# Altium project Controller.PrjPcb (part 5 of 5)

## Sheet bluetooth.SchDoc
size A4; SheetNumber: 4; SheetTotal: 8
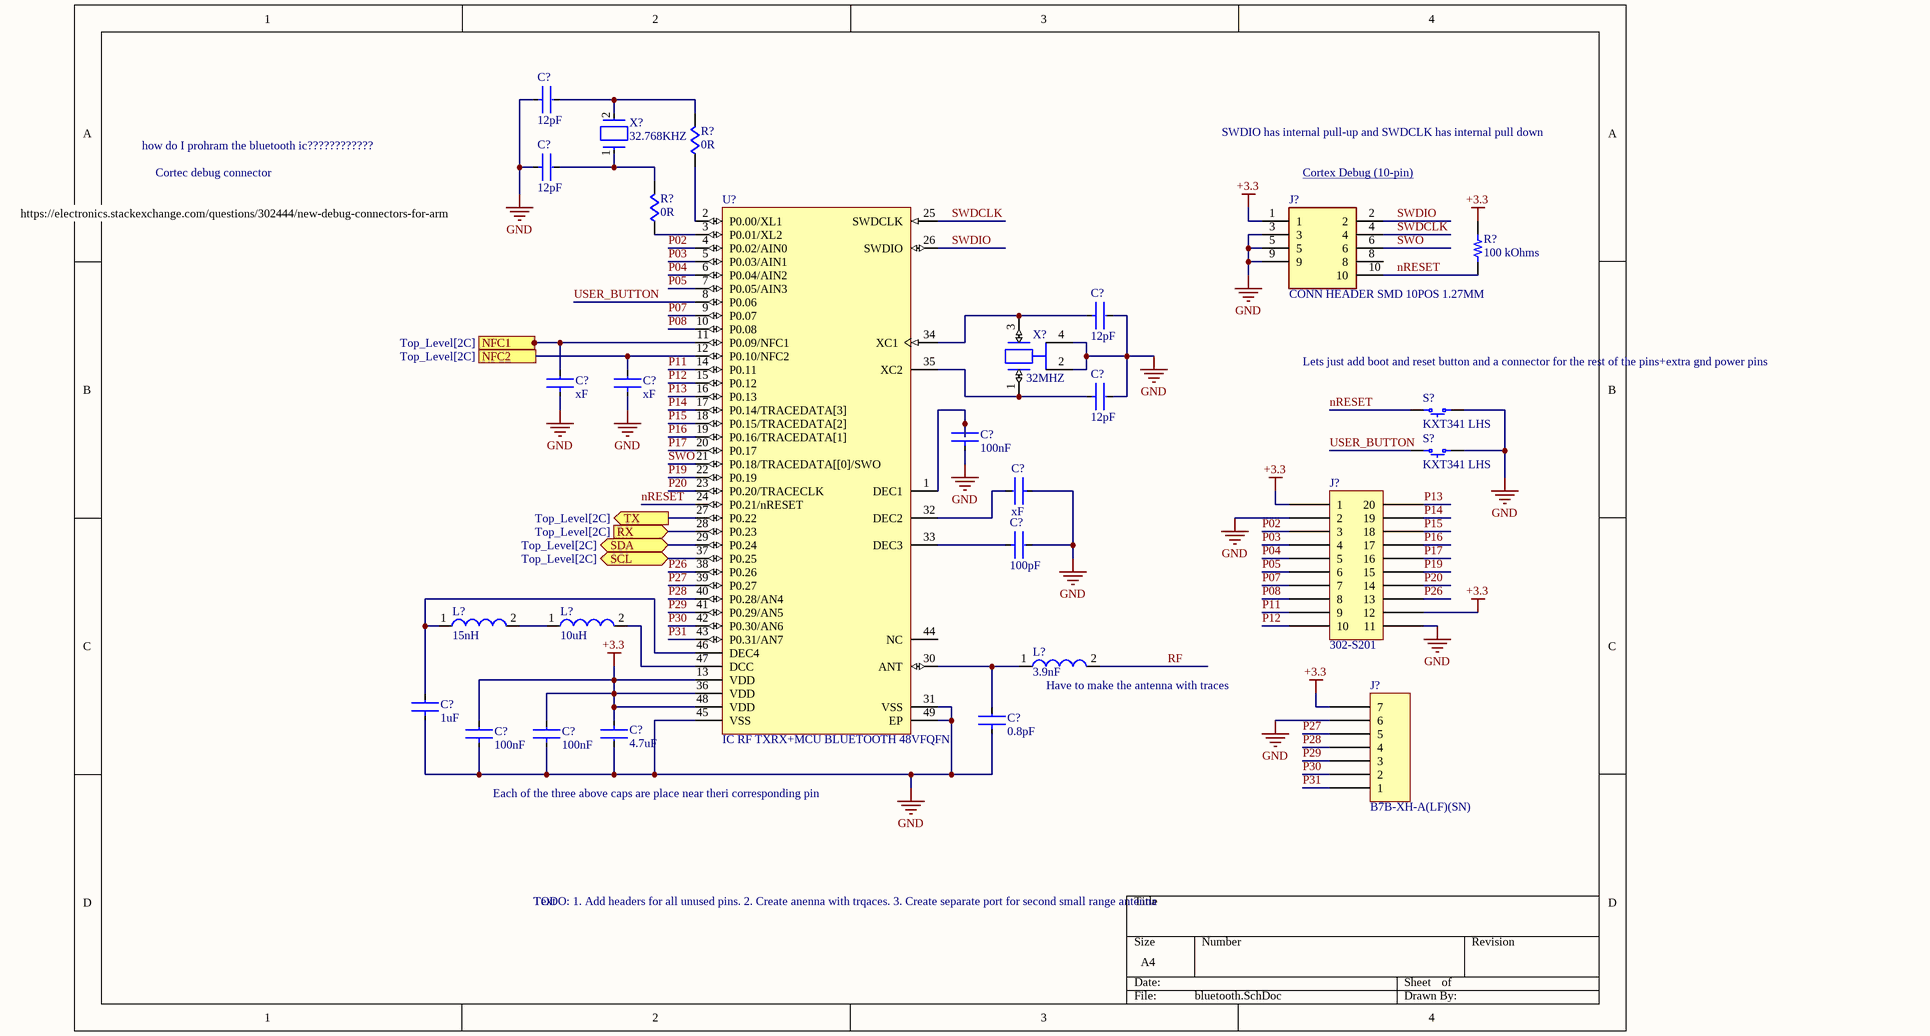
[diagram p5: bluetooth.SchDoc]

### Parts
(Parts that share a designator on the sheet are numbered #1, #2 ... from top to bottom, then left to right.)
C?#26  value 12pF  [FP-GCM155-0_05-IPC_C]  (hidden comment: NPO, +-2%)
C?#27  value 12pF  [FP-GCM155-0_05-IPC_C]  (hidden comment: NPO, +-2%)
C?#28  value 12pF  [FP-GCM155-0_05-IPC_C]  (hidden comment: NPO, +-2%)
C?#29  value xF  [FP-GCM155-0_05-IPC_C]  (hidden comment: tune)
C?#30  value xF  [FP-GCM155-0_05-IPC_C]  (hidden comment: tune)
C?#31  value 12pF  [FP-GCM155-0_05-IPC_C]  (hidden comment: NPO, +-2%)
C?#32  value 100nF  [FP-GCM155-0_05-IPC_C]  (hidden comment: X7R, +-10%)
C?#33  value xF  [FP-GCM155-0_05-IPC_C]  (hidden comment: tune)
C?#34  value 100pF  [FP-GCM155-0_05-IPC_C]  (hidden comment: NP0, +-5%)
C?#35  value 1uF  [FP-CGA3E-0_3-0_1-IPC_C]  (hidden comment: X7R, +-10%)
C?#36  value 0.8pF  [FP-GCM155-0_05-IPC_C]  (hidden comment: NP0, +-5%)
C?#37  value 100nF  [FP-GCM155-0_05-IPC_C]  (hidden comment: X7R, +-10%)
C?#38  value 100nF  [FP-GCM155-0_05-IPC_C]  (hidden comment: X7R, +-10%)
C?#39  value 4.7uF  [FP-CGA3E-0_3-0_1-IPC_C]  (hidden comment: X5R, +-10%)
J?#14  CONN HEADER SMD 10POS 1.27MM  [FTSH10501LDV007K]
J?#15  302-S201  [OST 302-S201]
J?#16  B7B-XH-A(LF)(SN)  [JST XH B7B-XH-A]
L?#2  value 15nH  [FP-LBMF1608-0_8-0_2-IPC_C]  (hidden comment: FIXED IND 15NH 500MA 500MOHM SMD)
L?#3  value 10uH  [FP-MLZ1608-IPC_C]  (hidden comment: FIXED IND 10UH 300MA 600MOHM SMD)
L?#4  value 3.9nF  (hidden comment: FIXED IND 3.9NH 200MA 750MOHM SM)
R?#23  value 0R  [FP-RK73Z1J-IPC_C]  (hidden comment: RES 0 OHM JUMPER 0603)
R?#24  value 0R  [FP-RK73Z1J-IPC_C]  (hidden comment: RES 0 OHM JUMPER 0603)
R?#25  100 kOhms  [RES 0402_1005]
S?#4  KXT341 LHS  [C&K KXT3]
S?#5  KXT341 LHS  [C&K KXT3]
U?#3  IC RF TXRX+MCU BLUETOOTH 48VFQFN
X?#2  value 32.768KHZ  [FP-ECX-34Q-MFG]  (hidden comment: ECS-.327-9-34QCS-TR)
X?#3  value 32MHZ  [FP-ECS-320-8-37CKM-MFG]  (hidden comment: CRYSTAL 32.0000MHZ 8PF SMD)

### Ports
NFC1 (see Top_Level[2C]), NFC2 (see Top_Level[2C]), RX (in, see Top_Level[2C]), SCL (bidir, see Top_Level[2C]), SDA (bidir, see Top_Level[2C]), TX (out, see Top_Level[2C])

### Nets
+3.3: C?#37.2 C?#38.2 C?#39.1 J?#14.1 J?#15.1 J?#15.12 J?#16.7 R?#25.2 U?#3.13(VDD) U?#3.36(VDD) U?#3.48(VDD)
GND: C?#26.1 C?#27.1 C?#28.2 C?#29.1 C?#30.1 C?#31.2 C?#32.1 C?#33.1 C?#34.2 C?#35.1 C?#36.1 C?#37.1 C?#38.1 C?#39.2 J?#14.3 J?#14.5 J?#14.9 J?#15.2 J?#15.11 J?#16.6 S?#4.1 S?#5.1 U?#3.31(VSS) U?#3.45(VSS) U?#3.49(EP) X?#3.2(Gnd) X?#3.4(Gnd)
nRESET: J?#14.10 R?#25.1 S?#4.2 U?#3.24(P0.21/nRESET)
P02: J?#15.3 U?#3.4(P0.02/AIN0)
P03: J?#15.4 U?#3.5(P0.03/AIN1)
P04: J?#15.5 U?#3.6(P0.04/AIN2)
P05: J?#15.6 U?#3.7(P0.05/AIN3)
P07: J?#15.7 U?#3.9(P0.07)
P08: J?#15.8 U?#3.10(P0.08)
P11: J?#15.9 U?#3.14(P0.11)
P12: J?#15.10 U?#3.15(P0.12)
P13: J?#15.20 U?#3.16(P0.13)
P14: J?#15.19 U?#3.17(P0.14/TRACEDATA[3])
P15: J?#15.18 U?#3.18(P0.15/TRACEDATA[2])
P16: J?#15.17 U?#3.19(P0.16/TRACEDATA[1])
P17: J?#15.16 U?#3.20(P0.17)
P19: J?#15.15 U?#3.22(P0.19)
P20: J?#15.14 U?#3.23(P0.20/TRACECLK)
P26: J?#15.13 U?#3.38(P0.26)
P27: J?#16.5 U?#3.39(P0.27)
P28: J?#16.4 U?#3.40(P0.28/AN4)
P29: J?#16.3 U?#3.41(P0.29/AN5)
P30: J?#16.2 U?#3.42(P0.30/AN6)
P31: J?#16.1 U?#3.43(P0.31/AN7)
RF: L?#4.2
SWDCLK: J?#14.4 U?#3.25(SWDCLK)
SWDIO: J?#14.2 U?#3.26(SWDIO)
SWO: J?#14.6 U?#3.21(P0.18/TRACEDATA[[0]/SWO)
USER_BUTTON: S?#5.2 U?#3.8(P0.06)
Net*_29: U?#3.37(P0.25) ; port SCL
Net*_43: U?#3.27(P0.22) ; port TX
Net*_53: U?#3.29(P0.24) ; port SDA
Net*_58: U?#3.28(P0.23) ; port RX
NetC?#26_2: C?#26.2 R?#23.2 X?#2.2(Out/In)
NetC?#27_2: C?#27.2 R?#24.2 X?#2.1(In/Out)
NetC?#28_1: C?#28.1 U?#3.34(XC1) X?#3.3(Out/In)
NetC?#29_2: C?#29.2 U?#3.11(P0.09/NFC1) ; port NFC1
NetC?#30_2: C?#30.2 U?#3.12(P0.10/NFC2) ; port NFC2
NetC?#31_1: C?#31.1 U?#3.35(XC2) X?#3.1(In/Out)
NetC?#32_2: C?#32.2 U?#3.1(DEC1)
NetC?#33_2: C?#33.2 U?#3.32(DEC2)
NetC?#34_1: C?#34.1 U?#3.33(DEC3)
NetC?#35_2: C?#35.2 L?#2.1 U?#3.46(DEC4)
NetC?#36_2: C?#36.2 L?#4.1 U?#3.30(ANT)
NetL?#2_2: L?#2.2 L?#3.1
NetL?#3_2: L?#3.2 U?#3.47(DCC)
NetR?#23_1: R?#23.1 U?#3.2(P0.00/XL1)
NetR?#24_1: R?#24.1 U?#3.3(P0.01/XL2)

Not connected (* = marked no-connect by the designer): J?#14 8; U?#3 44(NC)

### Notes on the sheet
- how do I prohram the bluetooth ic????????????
- Cortec debug connector
- SWDIO has internal pull-up and SWDCLK has internal pull down
- (near J?#14) Cortex Debug (10-pin) <https://developer.arm.com/documentation/101416/0100/Hardware-Description/Target-Interfaces/Cortex-Debug--10-pin->
- https://electronics.stackexchange.com/questions/302444/new-debug-connectors-for-arm
- (near S?#4) Lets just add boot and reset button and a connector for the rest of the pins+extra gnd power pins
- (near L?#4) Have to make the antenna with traces
- (near C?#39) Each of the three above caps are place near theri corresponding pin
- Text
- TODO: 1. Add headers for all unused pins. 2. Create anenna with trqaces. 3. Create separate port for second small range antenna

### Library data of the parts
C?#26-C?#34 C?#36-C?#38 = CAP 0402
C?#35 C?#39 = CAP 0603
J?#14 = FTSH-105-01-L-DV-007-K
J?#15 = 302-S201: CONN HEADER VERT 20POS 2.54MM; Manufacturer: On Shore Technology Inc.; Contact Length - Post: 0.122" (3.10mm); Current Rating (Amps): 3A; Material Flammability Rating: UL94 V-0; Number of Positions: 20; Number of Positions Loaded: All; Pitch - Mating: 0.100" (2.54mm); Shrouding: Shrouded - 4 Wall; Style: Board to Cable/Wire; Part Number: 302-S201; ComponentLink1Description: Datasheet; ComponentLink1URL: http://www.on-shore.com/wp-content/uploads/2018/04/302-SXX1.pdf; ComponentLink2Description: DigiKey Link; ComponentLink2URL: https://www.digikey.com/en/products/detail/on-shore-technology-inc/302-S201/2794235; Connector Type: Header; Contact Finish - Mating: Gold; Contact Finish - Post: Gold; Contact Finish Thickness - Mating: Flash; Contact Material: Brass; Contact Shape: Square; Contact Type: Male Pin; Fastening Type: Push-Pull; Features: Keying Slot; Insulation Color: Black; Insulation Height: 0.358" (9.10mm); Insulation Material: Polyester, Glass Filled; LastUpdated: 2022-08-14 5:03:46 PM; Lifecycle Status: Active; Minimum Order: 1; Mounting Type: Through Hole; Number of Rows: 2; Operating Temperature: -40°C ~ 105°C; Packaging: Tray; PartId: 155; Part Status: Active; Price: 0.19; Row Spacing - Mating: 0.100" (2.54mm); Series: 302; Supplier 1: DigiKey; Supplier Part Number 1: ED10524-ND; Termination: Solder
J?#16 = B7B-XH-A(LF)(SN): CONN HEADER VERT 7POS 2.5MM; Manufacturer: JST Sales America Inc.; Contact Length - Post: 0.134" (3.40mm); Current Rating (Amps): 3A; Material Flammability Rating: UL94 V-0; Number of Positions: 7; Number of Positions Loaded: All; Pitch - Mating: 0.098" (2.50mm); Shrouding: Shrouded - 4 Wall; Style: Board to Cable/Wire; Voltage Rating: 250V; Part Number: B7B-XH-A(LF)(SN); ComponentLink1Description: Datasheet; ComponentLink1URL: http://www.jst-mfg.com/product/pdf/eng/eXH.pdf; ComponentLink2Description: DigiKey Link; ComponentLink2URL: http://digikey.com/product-detail/en/jst-sales-america-inc/B7B-XH-A-LF-SN/455-2252-ND/1651050; Connector Type: Header; Contact Finish - Mating: Tin; Contact Finish - Post: Tin; Contact Material: Brass; Contact Shape: Square; Contact Type: Male Pin; Fastening Type: Detent Lock; Insulation Color: Natural; Insulation Height: 0.276" (7.00mm); Insulation Material: Polyamide (PA66), Nylon 6/6; LastUpdated: 2020-01-12 11:47:09 PM; Lifecycle Status: Active; Minimum Order: 1; Mounting Type: Through Hole; Number of Rows: 1; Operating Temperature: -25°C ~ 85°C; Packaging: Bulk; PartId: 72; Part Status: Active; Price: 0.33; Series: XH; Supplier 1: DigiKey; Supplier Part Number 1: 455-2252-ND; Termination: Press-Fit, Solder
L?#2 = 744786115A: Manufacturer: Wurth Electronics; Core Material: Ceramic; Inductance Tolerance: 5%; Shielding: Unshielded; DC Resistance (DCR): 500mR; Self Resonant Frequency: 2.3GHz; Test Frequency: 100MHz; Supplier: Digi-Key; Supplier Part Number: 732-6265-1-ND; Manufacturer Part Number: 744786115A; RoHS: Yes; Category: Fixed Inductors; Stock: 34669; Pricing: 1=0.21, 50=0.197, 100=0.185, 500=0.167, 1000=0.143, 2000=0.113 (USD); Mounting Technology: Surface Mount; Case/Package: 0603; Case Code (Metric): 1608; Case Code (Imperial): 0603; Min Operating Temperature: -55°C; Max Operating Temperature: 125°C; Packaging: Cut Tape; Current Rating: 500mA; Max DC Current: 500mA; Tolerance: 5%; Series: WE-MK; Length: 0.063inch; Width: 0.031inch; Height - Seated (Max): 0.037inch; RoHS Compliant: Yes; Reach SVHC Compliant: Unknown; ComponentLink1URL: http://www.farnell.com/datasheets/1818771.pdf?src-supplier=Farnell; ComponentLink1Description: http://www.farnell.com/datasheets/1818771.pdf?src-supplier=Farnell; ComponentLink2URL: http://www.farnell.com/datasheets/1818771.pdf?src-supplier=Element14; ComponentLink2Description: http://www.farnell.com/datasheets/1818771.pdf?src-supplier=Element14; ComponentLink3URL: https://katalog.we-online.de/pbs/datasheet/744786115A.pdf?src-supplier=Digi-Key; ComponentLink3Description: https://katalog.we-online.de/pbs/datasheet/744786115A.pdf?src-supplier=Digi-Key
L?#3 = MLZ1608N100LTD25: Manufacturer: TDK; Inductor Type: GENERAL PURPOSE INDUCTOR; Supplier: Digi-Key; Supplier Part Number: 445-17067-1-ND; Manufacturer Part Number: MLZ1608N100LTD25; RoHS: Yes; Category: Fixed Inductors; Stock: 118754; Pricing: 1=0.2, 10=0.177, 25=0.1576, 50=0.134, 100=0.1182, 250=0.10832, 500=0.09848, 1000=0.08272 (USD); Reach SVHC Compliant: Yes; RoHS Compliant: Yes; ComponentLink1URL: https://datasheet.ciiva.com:443/pdfs/VipMasterIC/IC/TDKC/TDKC-S-A0007713921/TDKC-S-A0007713921-1.pdf?src-supplier=IHS+Markit; ComponentLink1Description: https://datasheet.ciiva.com:443/pdfs/VipMasterIC/IC/TDKC/TDKC-S-A0007713921/TDKC-S-A0007713921-1.pdf?src-supplier=IHS+Markit; ComponentLink2URL: http://www.mouser.com/ds/2/400/nductor_commercial_decoupling_mlz1608_en-837720.pdf?src-supplier=Mouser; ComponentLink2Description: http://www.mouser.com/ds/2/400/nductor_commercial_decoupling_mlz1608_en-837720.pdf?src-supplier=Mouser; ComponentLink3URL: https://product.tdk.com/info/en/catalog/datasheets/inductor_automotive_decoupling_mlz1608_en.pdf?src-supplier=Digi-Key; ComponentLink3Description: https://product.tdk.com/info/en/catalog/datasheets/inductor_automotive_decoupling_mlz1608_en.pdf?src-supplier=Digi-Key; ComponentLink4URL: http://product.tdk.com/inductor/ind/en/documents/inductor_automotive_decoupling_mlz_en.pdf?src-supplier=Digi-Key; ComponentLink4Description: http://product.tdk.com/inductor/ind/en/documents/inductor_automotive_decoupling_mlz_en.pdf?src-supplier=Digi-Key
L?#4 = MHQ0402PSA3N9BT000: Manufacturer: TDK; Inductor Type: GENERAL PURPOSE INDUCTOR; Supplier: Digi-Key; Supplier Part Number: 445-174653-1-ND; Manufacturer Part Number: MHQ0402PSA3N9BT000; RoHS: Yes; Category: Fixed Inductors; Stock: 16837; Pricing: 1=0.1, 10=0.086, 25=0.0768, 50=0.0652, 100=0.0576, 250=0.05276, 500=0.04798, 1000=0.0403, 2500=0.03454 (USD); Reach SVHC Compliant: Yes; RoHS Compliant: Yes; ComponentLink1URL: https://datasheet.ciiva.com:443/pdfs/VipMasterIC/IC/TDKC/TDKC-S-A0007109881/TDKC-S-A0007109881-1.pdf?src-supplier=IHS+Markit; ComponentLink1Description: https://datasheet.ciiva.com:443/pdfs/VipMasterIC/IC/TDKC/TDKC-S-A0007109881/TDKC-S-A0007109881-1.pdf?src-supplier=IHS+Markit; ComponentLink2URL: https://product.tdk.com/info/en/catalog/datasheets/inductor_commercial_high-frequency_mhq0402psa_en.pdf?src-supplier=Digi-Key; ComponentLink2Description: https://product.tdk.com/info/en/catalog/datasheets/inductor_commercial_high-frequency_mhq0402psa_en.pdf?src-supplier=Digi-Key
R?#23 R?#24 = RK73Z1JTTD: Manufacturer: KOA Speer; Rated Temperature: 70°C; Package Height: 0.45mm; Package Length: 1.6mm; Package Width: 0.8mm; Reference Standard: AEC-Q200; Supplier: Digi-Key; Supplier Part Number: 2019-RK73Z1JTTDCT-ND; Manufacturer Part Number: RK73Z1JTTD; RoHS: Yes; Category: Chip SMD Resistors; Stock: 8562065; Pricing: 1=0.1, 10=0.016, 50=0.0088, 100=0.0065, 500=0.00396, 1000=0.00292 (USD); Mounting Technology: Surface Mount; Pins: 2; Case/Package: 0603; Terminal Finish: Nickel; Min Operating Temperature: -55°C; Max Operating Temperature: 155°C; JESD-609 Code: e3; Resistor Type: FIXED RESISTOR; Construction: Rectangular; Package Style: SMTMeter; Packaging: Tape and Reel; Termination: Wraparound; Reach SVHC Compliant: Yes; RoHS Compliant: Yes; ComponentLink1URL: https://datasheet.ciiva.com:443/pdfs/VipMasterIC/IC/KOAS/KOAS-S-A0009586251/KOAS-S-A0009586308-1.pdf?src-supplier=IHS+Markit; ComponentLink1Description: https://datasheet.ciiva.com:443/pdfs/VipMasterIC/IC/KOAS/KOAS-S-A0009586251/KOAS-S-A0009586308-1.pdf?src-supplier=IHS+Markit; ComponentLink2URL: https://datasheet.ciiva.com/7816/549012-7816884.pdf?src-supplier=Element14; ComponentLink2Description: https://datasheet.ciiva.com/7816/549012-7816884.pdf?src-supplier=Element14; ComponentLink3URL: https://datasheet.ciiva.com/26914/getdatasheetpartid-123499-26914653.pdf?src-supplier=Verical; ComponentLink3Description: https://datasheet.ciiva.com/26914/getdatasheetpartid-123499-26914653.pdf?src-supplier=Verical
R?#25 = AC0402JR-07100KL: RES SMD 100K OHM 5% 1/16W 0402; Manufacturer: Yageo; Power (Watts): 0.063W, 1/16W; Temperature Coefficient: ±100ppm/°C; Part Number: AC0402JR-07100KL; Value: 100 kOhms; ComponentLink1Description: Datasheet; ComponentLink1URL: https://www.yageo.com/upload/media/product/productsearch/datasheet/rchip/PYu-AC_51_RoHS_L_7.pdf; ComponentLink2Description: DigiKey Link; ComponentLink2URL: https://www.digikey.com/en/products/detail/yageo/AC0402JR-07100KL/5895569; Composition: Thick Film; Device Package: 0402 (1005 Metric); Features: Automotive AEC-Q200, Moisture Resistant; Height - Seated (Max): 0.015" (0.37mm); LastUpdated: 2023-06-08 7:32:26 PM; Lifecycle Status: Active; Minimum Order: 1; Number of Terminations: 2; Operating Temperature: -55°C ~ 155°C; Package / Case: 0402 (1005 Metric); Packaging: CutTape; PartId: 3380; Part Status: Active; Price: 0.01; Ratings: AEC-Q200; Resistance: 100 kOhms; Series: AC; Size / Dimension: 0.039" L x 0.020" W (1.00mm x 0.50mm); Supplier 1: DigiKey; Supplier Part Number 1: YAG3515CT-ND; Supplier Device Package: 0402; Tolerance: ±5%
S?#4 S?#5 = KXT341 LHS: SWITCH TACTILE SPST-NO 0.02A 15V; Manufacturer: C&K; Actuator Height off PCB, Vertical: 0.60mm; Actuator Orientation: Top Actuated; Actuator Type: Standard; Contact Rating @ Voltage: 0.02A @ 15VDC; Illumination: Non-Illuminated; Operating Force: 330gf; Outline: 3.00mm x 2.00mm; Switch Function: Off-Mom; Part Number: KXT341 LHS; Circuit: SPST-NO; ComponentLink1Description: Datasheet; ComponentLink1URL: https://dznh3ojzb2azq.cloudfront.net/products/Tactile/KXT3/documents/datasheet.pdf; ComponentLink2Description: DigiKey Link; ComponentLink2URL: https://www.digikey.com/en/products/detail/c-k/KXT341-LHS/6607322; LastUpdated: 2023-06-04 8:46:36 PM; Lifecycle Status: Active; Minimum Order: 1; Mounting Type: Surface Mount; Operating Temperature: -40°C ~ 85°C; Packaging: TapeAndReel; Part Status: Active; Price: 0.13; Series: KXT3; Supplier 1: DigiKey; Supplier Part Number 1: CKN10781CT-ND; Termination Style: SMD (SMT) Tab
U?#3 = NRF52832-QFAA-R: Manufacturer: Nordic Semiconductor; Channels: 1; Nominal Supply Voltage: 3V; Telecom IC Type: TELECOM CIRCUIT; Supplier: Digi-Key; Supplier Part Number: 4823-NRF52832-QFAA-RCT-ND; Manufacturer Part Number: NRF52832-QFAA-R; RoHS: Yes; Category: RF Receivers, Transceivers; Stock: 373904; Pricing: 1=5.81, 10=5.189, 25=4.67, 100=4.2547, 250=3.83964, 500=3.4453, 1000=2.90567 (USD); Case/Package: HVQCCN; Pins: 48; Package Shape: Square; Min Operating Temperature: -40°C; Max Operating Temperature: 85°C; JESD-30 Code: S-XQCC-N48; Package Style: CHIP CARRIER, HEAT SINK/SLUG, VERY THIN PROFILEMeter; Surface Mount: Yes; Terminal Form: No Lead; Terminal Position: QUAD; Length: 6mm; Width: 6mm; Height - Seated (Max): 0.95mm; Terminal Pitch: 0.4mm; Temperature Grade: INDUSTRIAL; Reach SVHC Compliant: Yes; RoHS Compliant: Yes; ComponentLink1URL: https://datasheet.ciiva.com:443/pdfs/VipMasterIC/IC/NRSA/NRSA-S-A0002414264/NRSA-S-A0002414264-1.pdf?src-supplier=IHS+Markit; ComponentLink1Description: https://datasheet.ciiva.com:443/pdfs/VipMasterIC/IC/NRSA/NRSA-S-A0002414264/NRSA-S-A0002414264-1.pdf?src-supplier=IHS+Markit; ComponentLink2URL: http://www.mouser.com/ds/2/297/nRF52832%20Product%20Brief%20v1.2-890472.pdf?src-supplier=Mouser; ComponentLink2Description: http://www.mouser.com/ds/2/297/nRF52832%20Product%20Brief%20v1.2-890472.pdf?src-supplier=Mouser; ComponentLink3URL: http://infocenter.nordicsemi.com/pdf/nRF52832_PB_v1.7.pdf?src-supplier=Digi-Key; ComponentLink3Description: http://infocenter.nordicsemi.com/pdf/nRF52832_PB_v1.7.pdf?src-supplier=Digi-Key; ComponentLink4URL: http://infocenter.nordicsemi.com/pdf/nRF52832_PS_v1.4.pdf?src-supplier=Digi-Key; ComponentLink4Description: http://infocenter.nordicsemi.com/pdf/nRF52832_PS_v1.4.pdf?src-supplier=Digi-Key
X?#2 = ECS-.327-9-34QCS-TR: CRYSTAL 32.768KHZ 9PF SMD; Manufacturer: ECS International; Supplier: Digi-Key; Supplier Part Number: XC2160CT-ND; Manufacturer Part Number: ECS-.327-9-34QCS-TR; RoHS: Yes; Category: Crystals; Stock: 10283; Pricing: 1=1.12, 10=0.99, 50=0.9252, 100=0.8175, 500=0.7745, 1000=0.64542 (USD); ComponentLink1URL: http://www.ecsxtal.com/store/pdf/partnumber4.pdf?src-supplier=Digi-Key; ComponentLink1Description: http://www.ecsxtal.com/store/pdf/partnumber4.pdf?src-supplier=Digi-Key; ComponentLink2URL: https://www.ecsxtal.com/store/pdf/ECX-34Q.pdf?src-supplier=Digi-Key; ComponentLink2Description: https://www.ecsxtal.com/store/pdf/ECX-34Q.pdf?src-supplier=Digi-Key
X?#3 = ECS-320-8-37CKM: Manufacturer: ECS International; Supplier: Digi-Key; Supplier Part Number: XC1547CT-ND; Manufacturer Part Number: ECS-320-8-37CKM; RoHS: Yes; Category: Crystals; Stock: 683720; Pricing: 1=0.92, 10=0.813, 50=0.76, 100=0.6716, 500=0.63624 (USD); ComponentLink1URL: https://datasheet.ciiva.com/854/ecx-1637-854098.pdf?src-supplier=Digi-Key; ComponentLink1Description: https://datasheet.ciiva.com/854/ecx-1637-854098.pdf?src-supplier=Digi-Key; ComponentLink2URL: https://datasheet.ciiva.com/854/ecx-1637-854099.pdf?src-supplier=Digi-Key; ComponentLink2Description: https://datasheet.ciiva.com/854/ecx-1637-854099.pdf?src-supplier=Digi-Key; ComponentLink3URL: https://datasheet.ciiva.com/854/ecx-1637-854100.pdf?src-supplier=Digi-Key; ComponentLink3Description: https://datasheet.ciiva.com/854/ecx-1637-854100.pdf?src-supplier=Digi-Key

## Sheet SD.SchDoc
size A4; SheetNumber: 8; SheetTotal: 8
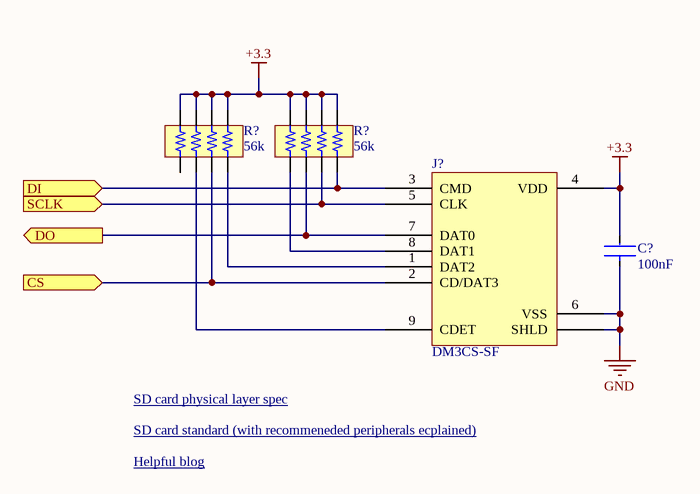
[diagram p6: SD.SchDoc]

### Parts
(Parts that share a designator on the sheet are numbered #1, #2 ... from top to bottom, then left to right.)
C?#40  value 100nF  [FP-CGA3E-0_3-0_1-IPC_C]  (hidden comment: CER 0.1UF 50V X7R 0603)
J?#17  DM3CS-SF  [HIROSE DM3CS]
R?#26  Resistance (Ohms): 56k  [RESNET 0804-8 CONVEX]  (hidden comment: EXB-28V563JX)
R?#27  Resistance (Ohms): 56k  [RESNET 0804-8 CONVEX]  (hidden comment: EXB-28V563JX)

### Ports
CS (in), DI (in), DO (out), SCLK (in)

### Nets
+3.3: C?#40.2 J?#17.4(VDD) R?#26.5 R?#26.6 R?#26.7 R?#26.8 R?#27.1 R?#27.2 R?#27.3 R?#27.4
GND: C?#40.1 J?#17.6(VSS) J?#17.S(SHLD)
Net*_2: J?#17.2(CD/DAT3) R?#26.3 ; port CS
Net*_9: J?#17.3(CMD) R?#27.8 ; port DI
Net*_51: J?#17.5(CLK) R?#27.7 ; port SCLK
Net*_52: J?#17.7(DAT0) R?#27.6 ; port DO
NetJ?#17_1: J?#17.1(DAT2) R?#26.4
NetJ?#17_8: J?#17.8(DAT1) R?#27.5
NetJ?#17_9: J?#17.9(CDET) R?#26.2

Not connected (* = marked no-connect by the designer): R?#26 1

### Notes on the sheet
- SD card physical layer spec <http://users.ece.utexas.edu/~valvano/EE345M/SD_Physical_Layer_Spec.pdf >
- SD card standard (with recommeneded peripherals ecplained) <https://www.jedec.org/system/files/docs/JESD84-A41.pdf>
- Helpful blog <http://elm-chan.org/docs/mmc/mmc_e.html>

### Library data of the parts
C?#40 = CGA3E2X7R1H104K080AA: Manufacturer: TDK; Dielectric Material: Ceramic; Multilayer: Yes; Tolerance  (fill in as +-): 10%; Reference Standard: AEC-Q200; Supplier: Digi-Key; Supplier Part Number: 445-5666-1-ND; Manufacturer Part Number: CGA3E2X7R1H104K080AA; RoHS: Yes; Category: Ceramic Capacitors; Stock: 7530246; Pricing: 1=0.1, 10=0.067, 50=0.0364, 100=0.0297, 500=0.0212, 1000=0.01666 (USD); Mounting Technology: Surface Mount; Pins: 2; Package Shape: Rectangular; Case/Package: 0603; Terminal Finish: Nickel; Min Operating Temperature: -55°C; Max Operating Temperature: 125°C; Capacitor Type: Ceramic; JESD-609 Code: e3; Package Style: SMTMeter; Packaging: Tape and Reel; Tolerance (fill in as +-): 10%; Rated DC Voltage (URdc): 50V; Temperature Characteristics Code: X7R; Termination: Wraparound; Length: 1.6mm; Width: 0.8mm; Height: 0.8mm; Reach SVHC Compliant: Yes; RoHS Compliant: Yes; ComponentLink1URL: https://datasheet.ciiva.com:443/pdfs/VipMasterIC/IC/TDKC/TDKC-S-A0008953915/TDKC-S-A0008953915-1.pdf?src-supplier=IHS+Markit; ComponentLink1Description: https://datasheet.ciiva.com:443/pdfs/VipMasterIC/IC/TDKC/TDKC-S-A0008953915/TDKC-S-A0008953915-1.pdf?src-supplier=IHS+Markit; ComponentLink2URL: https://datasheet.ciiva.com/24216/cga3e2x7r1h104k080aa-266291-24216208.pdf?src-supplier=Mouser; ComponentLink2Description: https://datasheet.ciiva.com/24216/cga3e2x7r1h104k080aa-266291-24216208.pdf?src-supplier=Mouser; ComponentLink3URL: https://datasheet.ciiva.com/15192/getdatasheetpartid-715867-15192412.pdf?src-supplier=Verical; ComponentLink3Description: https://datasheet.ciiva.com/15192/getdatasheetpartid-715867-15192412.pdf?src-supplier=Verical; ComponentLink4URL: https://datasheet.ciiva.com/23803/1936565-23803084.pdf?src-supplier=Newark; ComponentLink4Description: https://datasheet.ciiva.com/23803/1936565-23803084.pdf?src-supplier=Newark; ComponentLink5URL: https://datasheet.ciiva.com/22725/1735392-22725642.pdf?src-supplier=Element14; ComponentLink5Description: https://datasheet.ciiva.com/22725/1735392-22725642.pdf?src-supplier=Element14; ComponentLink6URL: https://datasheet.ciiva.com/46385/1735392-46385708.pdf?src-supplier=Element14; ComponentLink6Description: https://datasheet.ciiva.com/46385/1735392-46385708.pdf?src-supplier=Element14; ComponentLink7URL: https://datasheet.ciiva.com/16500/mlccspec-automotive-general-midvoltage-en-16500693.pdf?src-supplier=Future+Electronics; ComponentLink7Description: https://datasheet.ciiva.com/16500/mlccspec-automotive-general-midvoltage-en-16500693.pdf?src-supplier=Future+Electronics
J?#17 = DM3CS-SF: CONN MICRO SD CARD HINGED TYPE; Manufacturer: Hirose Electric Co Ltd; Card Type: Secure Digital - microSD™; Connector Type: Connector; Insertion, Removal Method: Hinged Lid; Number of Positions: 10 (8 + 2); Part Number: DM3CS-SF; ComponentLink1Description: Datasheet; ComponentLink1URL: https://www.hirose.com/product/document?clcode=CL0609-0033-6-00&productname=DM3AT-SF-PEJ2M5&series=DM3&documenttype=Catalog&lang=en&documentid=D49662_en; ComponentLink2Description: DigiKey Link; ComponentLink2URL: //digikey.com/product-detail/en/hirose-electric-co-ltd/DM3CS-SF/HR1972TR-ND/2602739; Contact Finish: Gold; Features: Switch; Height Above Board: 0.072" (1.83mm); LastUpdated: 2019-12-16 8:36:12 PM; Lifecycle Status: 0; Minimum Order: 1; Mounting Feature: Normal, Standard - Top; Mounting Type: Surface Mount, Right Angle; Packaging: TapeAndReel; Part Status: Active; Price: 0.77; Series: DM3; Supplier 1: DigiKey; Supplier Part Number 1: HR1972TR-ND
R?#26 R?#27 = EXB-28V563JX: RES ARRAY 4 RES 56K OHM 0804; Manufacturer: Panasonic Electronic Components; Circuit Type: Isolated; Number of Resistors: 4; Power Per Element: 62.5mW; Temperature Coefficient: ±200ppm/°C; Tolerance: ±5%; Part Number: EXB-28V563JX; Applications: Automotive AEC-Q200; ComponentLink1Description: Datasheet; ComponentLink1URL: https://industrial.panasonic.com/cdbs/www-data/pdf/AOC0000/AOC0000C14.pdf; ComponentLink2Description: DigiKey Link; ComponentLink2URL: https://www.digikey.com/en/products/detail/panasonic-electronic-components/EXB-28V563JX/256308; Height - Seated (Max): 0.018" (0.45mm); LastUpdated: 2023-06-05 8:46:36 PM; Lifecycle Status: Active; Minimum Order: 1; Mounting Type: Surface Mount; Number of Pins: 8; Operating Temperature: -55°C ~ 125°C; Package / Case: 0804, Convex, Long Side Terminals; Packaging: TapeAndReel; PartId: 421; Part Status: Active; Price: 0.01; Series: EXB; Size / Dimension: 0.079" L x 0.039" W (2.00mm x 1.00mm); Supplier 1: DigiKey; Supplier Part Number 1: Y7563CT-ND; Supplier Device Package: 0804

## Sheet TEMP.SchDoc
size A4; SheetNumber: 7; SheetTotal: 8
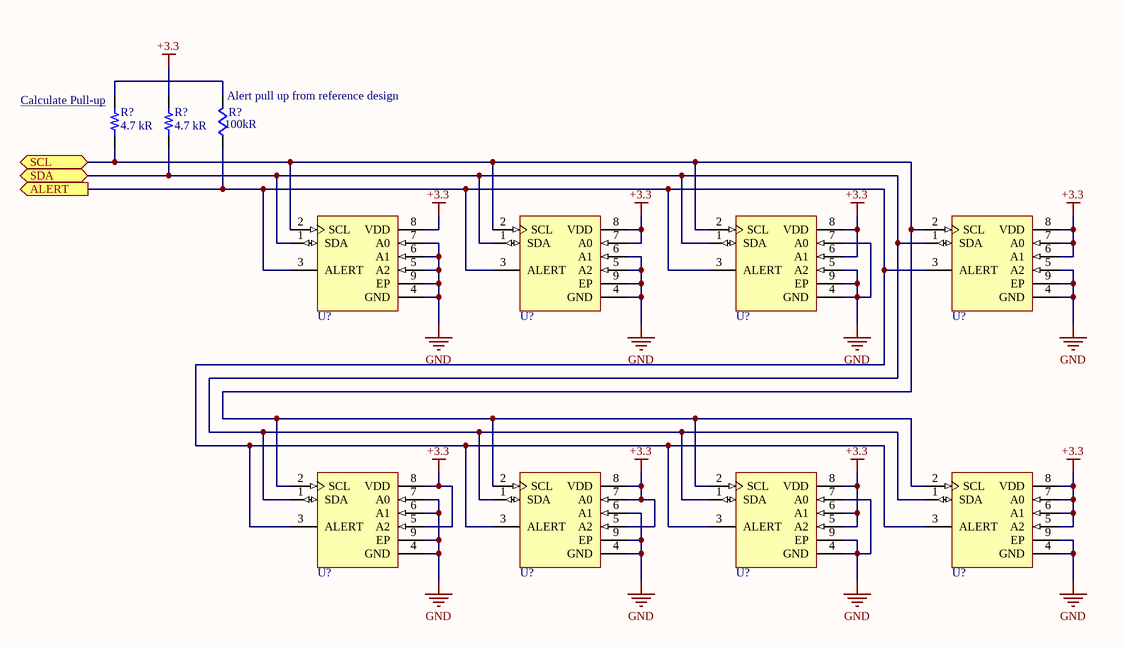
[diagram p7: TEMP.SchDoc]

### Parts
(Parts that share a designator on the sheet are numbered #1, #2 ... from top to bottom, then left to right.)
R?#28  4.7 kR  [RES 0603_1608]
R?#29  4.7 kR  [RES 0603_1608]
R?#30  value 100kR  [FP-RMCF0603-IPC_C]  (hidden comment: RES 100K OHM 1% 1/10W 0603)
U?#4  Temperature Sensor Digital, Local -40°C ~ 125°C 12 b 8-DFN (2x3)  [MCHP-DFN-MC8_V]  (value not drawn)
U?#5  Temperature Sensor Digital, Local -40°C ~ 125°C 12 b 8-DFN (2x3)  [MCHP-DFN-MC8_V]  (value not drawn)
U?#6  Temperature Sensor Digital, Local -40°C ~ 125°C 12 b 8-DFN (2x3)  [MCHP-DFN-MC8_V]  (value not drawn)
U?#7  Temperature Sensor Digital, Local -40°C ~ 125°C 12 b 8-DFN (2x3)  [MCHP-DFN-MC8_V]  (value not drawn)
U?#8  Temperature Sensor Digital, Local -40°C ~ 125°C 12 b 8-DFN (2x3)  [MCHP-DFN-MC8_V]  (value not drawn)
U?#9  Temperature Sensor Digital, Local -40°C ~ 125°C 12 b 8-DFN (2x3)  [MCHP-DFN-MC8_V]  (value not drawn)
U?#10  Temperature Sensor Digital, Local -40°C ~ 125°C 12 b 8-DFN (2x3)  [MCHP-DFN-MC8_V]  (value not drawn)
U?#11  Temperature Sensor Digital, Local -40°C ~ 125°C 12 b 8-DFN (2x3)  [MCHP-DFN-MC8_V]  (value not drawn)

### Ports
ALERT (out), SCL (bidir), SDA (bidir)

### Nets
+3.3: R?#29.2 U?#4.8(VDD) U?#5.7(A0) U?#5.8(VDD) U?#6.6(A1) U?#6.8(VDD) U?#7.6(A1) U?#7.7(A0) U?#7.8(VDD) U?#8.5(A2) U?#8.8(VDD) U?#9.5(A2) U?#9.7(A0) U?#9.8(VDD) U?#10.5(A2) U?#10.6(A1) U?#10.8(VDD) U?#11.5(A2) U?#11.6(A1) U?#11.7(A0) U?#11.8(VDD)
GND: U?#4.4(GND) U?#4.5(A2) U?#4.6(A1) U?#4.7(A0) U?#4.9(EP) U?#5.4(GND) U?#5.5(A2) U?#5.6(A1) U?#5.9(EP) U?#6.4(GND) U?#6.5(A2) U?#6.7(A0) U?#6.9(EP) U?#7.4(GND) U?#7.5(A2) U?#7.9(EP) U?#8.4(GND) U?#8.6(A1) U?#8.7(A0) U?#8.9(EP) U?#9.4(GND) U?#9.6(A1) U?#9.9(EP) U?#10.4(GND) U?#10.7(A0) U?#10.9(EP) U?#11.4(GND) U?#11.9(EP)
Net*_36: R?#30.1 U?#4.3(ALERT) U?#5.3(ALERT) U?#6.3(ALERT) U?#7.3(ALERT) U?#8.3(ALERT) U?#9.3(ALERT) U?#10.3(ALERT) U?#11.3(ALERT) ; port ALERT
Net*_40: R?#29.1 U?#4.1(SDA) U?#5.1(SDA) U?#6.1(SDA) U?#7.1(SDA) U?#8.1(SDA) U?#9.1(SDA) U?#10.1(SDA) U?#11.1(SDA) ; port SDA
Net*_41: R?#28.1 U?#4.2(SCL) U?#5.2(SCL) U?#6.2(SCL) U?#7.2(SCL) U?#8.2(SCL) U?#9.2(SCL) U?#10.2(SCL) U?#11.2(SCL) ; port SCL
NetR?#28_2: R?#28.2 R?#30.2

### Notes on the sheet
- (near R?#28) Calculate Pull-up <https://www.ti.com/lit/an/slva689/slva689.pdf?ts=1685337066349#:~:text=Once%20the%20minimum%20and%20maximum,will%20give%20lower%20power%20consumption>
- (near R?#30) Alert pull up from reference design

### Library data of the parts
R?#28 R?#29 = RK73H1JTTD4701F: RES 4.7K OHM 1% 1/10W 0603; Manufacturer: KOA Speer Electronics, Inc.; Power (Watts): 0.1W, 1/10W; Resistance: 4.7 kOhms; Temperature Coefficient: ±100ppm/°C; Part Number: RK73H1JTTD4701F; Value: 4.7 kR; ComponentLink1Description: Datasheet; ComponentLink1URL: http://www.koaspeer.com/catimages/Products/RK73H/RK73H.pdf; ComponentLink2Description: DigiKey Link; ComponentLink2URL: https://www.digikey.com/en/products/detail/koa-speer-electronics-inc/RK73H1JTTD4701F/9844854; Composition: Thick Film; Device Package: 0603 (1608 Metric); Features: Automotive AEC-Q200, Moisture Resistant; Height - Seated (Max): 0.022" (0.55mm); LastUpdated: 2023-06-05 7:46:28 PM; Lifecycle Status: Active; Minimum Order: 1; Number of Terminations: 2; Operating Temperature: -55°C ~ 155°C; Package / Case: 0603 (1608 Metric); Packaging: CutTape; PartId: 22938; Part Status: Active; Price: 0.01; Ratings: AEC-Q200; Series: RK73H; Size / Dimension: 0.063" L x 0.031" W (1.60mm x 0.80mm); Supplier 1: DigiKey; Supplier Part Number 1: 2019-RK73H1JTTD4701FCT-ND; Supplier Device Package: 0603; Tolerance: ±1%
R?#30 = RMCF0603FT100K: Manufacturer: Stackpole Electronics; Power: 100mW; Rated Temperature: 70°C; Temperature Coefficient: 100ppm/°C; Working Voltage: 75V; Package Height: 0.45mm; Package Length: 1.55mm; Package Width: 0.8mm; Reference Standard: AEC-Q200; Supplier: Digi-Key; Supplier Part Number: RMCF0603FT100KCT-ND; Manufacturer Part Number: RMCF0603FT100K; RoHS: Yes; Category: Chip SMD Resistors; Stock: 5870957; Pricing: 1=0.1, 10=0.015, 50=0.009, 100=0.0075, 500=0.00498, 1000=0.00425 (USD); Mounting Technology: Surface Mount; Pins: 2; Package Shape: Rectangular; Case/Package: 0603; Terminal Finish: Nickel; Min Operating Temperature: -55°C; Max Operating Temperature: 155°C; Tolerance: 1%; JESD-609 Code: e3; Resistor Type: FIXED RESISTOR; Construction: Rectangular; Package Style: SMTMeter; Packaging: Tape and Reel; Technology: METAL GLAZE/THICK FILM; Termination: Wraparound; Reach SVHC Compliant: Yes; RoHS Compliant: Yes; ComponentLink1URL: https://datasheet.ciiva.com:443/pdfs/VipMasterIC/IC/SEIE/SEIE-S-A0009541969/SEIE-S-A0009541969-1.pdf?src-supplier=IHS+Markit; ComponentLink1Description: https://datasheet.ciiva.com:443/pdfs/VipMasterIC/IC/SEIE/SEIE-S-A0009541969/SEIE-S-A0009541969-1.pdf?src-supplier=IHS+Markit; ComponentLink2URL: https://datasheet.ciiva.com/15193/getdatasheetpartid-362597-15193437.pdf?src-supplier=Verical; ComponentLink2Description: https://datasheet.ciiva.com/15193/getdatasheetpartid-362597-15193437.pdf?src-supplier=Verical
U?#4-U?#11 = MCP9808T-E/MC: Manufacturer: Microchip; Package Body Material: Plastic; Package Shape/Style: Rectangular; Accuracy-Max (Cel): 1°C; Number of Bits: 16; Operating Current-Max: 200uA; Output Interface Type: 2-Wire; Power Supplies: 3/5V; Sensor Type: TEMPERATURE SENSOR,SWITCH/DIGITAL OUTPUT,SERIAL; Max Supply Voltage: 5.5V; Min Supply Voltage: 2.7V; Body Breadth: 2inch; Body Height: 0.9mm; Body Length or Diameter: 3mm; Supplier: Digi-Key; Supplier Part Number: MCP9808T-E/MCCT-ND; Manufacturer Part Number: MCP9808T-E/MC; RoHS: Yes; Category: Temperature and Humidity Sensors; Stock: 21735; Pricing: 1=1.4, 25=1.17, 100=1.05 (USD); Mounting Technology: Surface Mount; Pins: 8; Housing Material: Plastic; Terminal Finish: Tin; Min Operating Temperature: -40°C; Max Operating Temperature: 125°C; JESD-609 Code: e3; Termination: Solder; RoHS Compliant: Yes; Reach SVHC Compliant: Yes; ComponentLink1URL: https://datasheet.ciiva.com:443/pdfs/VipMasterIC/IC/MCHP/MCHP-S-A0005985417/MCHP-S-A0005985417-1.pdf?src-supplier=IHS+Markit; ComponentLink1Description: https://datasheet.ciiva.com:443/pdfs/VipMasterIC/IC/MCHP/MCHP-S-A0005985417/MCHP-S-A0005985417-1.pdf?src-supplier=IHS+Markit; ComponentLink2URL: https://datasheet.ciiva.com/15098/getdatasheetpartid-508406-15098545.pdf?src-supplier=Verical; ComponentLink2Description: https://datasheet.ciiva.com/15098/getdatasheetpartid-508406-15098545.pdf?src-supplier=Verical; ComponentLink3URL: https://datasheet.ciiva.com/2002/25095a-2002857.pdf?src-supplier=Digi-Key; ComponentLink3Description: https://datasheet.ciiva.com/2002/25095a-2002857.pdf?src-supplier=Digi-Key; ComponentLink4URL: https://datasheet.ciiva.com/14152/mcp9808-eng-tds-14152155.pdf?src-supplier=Distrelec; ComponentLink4Description: https://datasheet.ciiva.com/14152/mcp9808-eng-tds-14152155.pdf?src-supplier=Distrelec; ComponentLink5URL: https://datasheet.ciiva.com/1514/1522173-1514018.pdf?src-supplier=Element14; ComponentLink5Description: https://datasheet.ciiva.com/1514/1522173-1514018.pdf?src-supplier=Element14

## Sheet Voltage_OpAmp.SchDoc
size A4; SheetNumber: 1; SheetTotal: 9
Used 2 times, as channels U_Voltage_OpAmp, U_Voltage_OpAmp. Parts and nets are listed once, with the designators drawn on the sheet.
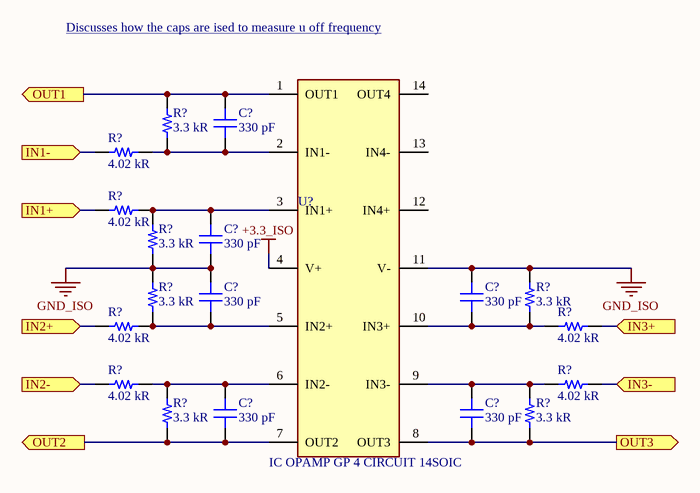
[diagram p8: Voltage_OpAmp.SchDoc]

### Parts
(Parts that share a designator on the sheet are numbered #1, #2 ... from top to bottom, then left to right.)
C?#1  330 pF  [CAP 0402_1005]
C?#2  330 pF  [CAP 0402_1005]
C?#3  330 pF  [CAP 0402_1005]
C?#4  330 pF  [CAP 0402_1005]
C?#5  330 pF  [CAP 0402_1005]
C?#6  330 pF  [CAP 0402_1005]
R?#1  3.3 kR  [RES 0402_1005]
R?#2  4.02 kR  [RES 0402_1005]
R?#3  4.02 kR  [RES 0402_1005]
R?#4  3.3 kR  [RES 0402_1005]
R?#5  3.3 kR  [RES 0402_1005]
R?#6  3.3 kR  [RES 0402_1005]
R?#7  4.02 kR  [RES 0402_1005]
R?#8  4.02 kR  [RES 0402_1005]
R?#9  4.02 kR  [RES 0402_1005]
R?#10  4.02 kR  [RES 0402_1005]
R?#11  3.3 kR  [RES 0402_1005]
R?#12  3.3 kR  [RES 0402_1005]
U?  IC OPAMP GP 4 CIRCUIT 14SOIC  [SOIC127P600X175-14N]

### Ports
IN1+ (in), IN1- (in), IN2+ (in), IN2- (in), IN3+ (in), IN3- (in), OUT1 (out), OUT2 (out), OUT3 (out)

### Nets
+3.3_ISO: U?.4(V+)
GND_ISO: C?#2.1 C?#3.2 C?#4.2 R?#4.1 R?#5.2 R?#6.2 U?.11(V-)
IN1+: R?#3.1 ; port IN1+
IN1-: R?#2.1 ; port IN1-
IN2+: R?#7.1 ; port IN2+
IN2-: R?#9.1 ; port IN2-
IN3+: R?#8.2 ; port IN3+
IN3-: R?#10.2 ; port IN3-
OUT1: C?#1.2 R?#1.2 U?.1(OUT1) ; port OUT1
OUT2: C?#5.1 R?#11.1 U?.7(OUT2) ; port OUT2
OUT3: C?#6.1 R?#12.1 U?.8(OUT3) ; port OUT3
NetC?#1_1: C?#1.1 R?#1.1 R?#2.2 U?.2(IN1-)
NetC?#2_2: C?#2.2 R?#3.2 R?#4.2 U?.3(IN1+)
NetC?#3_1: C?#3.1 R?#5.1 R?#7.2 U?.5(IN2+)
NetC?#4_1: C?#4.1 R?#6.1 R?#8.1 U?.10(IN3+)
NetC?#5_2: C?#5.2 R?#9.2 R?#11.2 U?.6(IN2-)
NetC?#6_2: C?#6.2 R?#10.1 R?#12.2 U?.9(IN3-)

Not connected (* = marked no-connect by the designer): U? 12(IN4+) 13(IN4-) 14(OUT4)

### Channels
U_Voltage_OpAmp: designators C?=C?_U_Voltage_OpAmp#1 C?=C?_U_Voltage_OpAmp#2 C?=C?_U_Voltage_OpAmp#5 C?=C?_U_Voltage_OpAmp#3 C?=C?_U_Voltage_OpAmp#6 C?=C?_U_Voltage_OpAmp#4 R?=R?_U_Voltage_OpAmp#2 R?=R?_U_Voltage_OpAmp#1 R?=R?_U_Voltage_OpAmp#3 R?=R?_U_Voltage_OpAmp#4 R?=R?_U_Voltage_OpAmp#11 R?=R?_U_Voltage_OpAmp#9 R?=R?_U_Voltage_OpAmp#7 R?=R?_U_Voltage_OpAmp#5 R?=R?_U_Voltage_OpAmp#10 R?=R?_U_Voltage_OpAmp#12 R?=R?_U_Voltage_OpAmp#8 R?=R?_U_Voltage_OpAmp#6 U?=U?_U_Voltage_OpAmp#1; ports IN1+=NetR?_U_Voltage_OpAmp#3_1 IN1-=NetR?_U_Voltage_OpAmp#2_1 IN2+=NetR?_U_Voltage_OpAmp#7_1 IN2-=NetR?_U_Voltage_OpAmp#9_1 IN3+=NetR?_U_Voltage_OpAmp#8_2 IN3-=NetR?_U_Voltage_OpAmp#10_2 OUT1=Net*_23 OUT2=Net*_10 OUT3=Net*_22
U_Voltage_OpAmp: designators C?=C?_U_Voltage_OpAmp#7 C?=C?_U_Voltage_OpAmp#8 C?=C?_U_Voltage_OpAmp#11 C?=C?_U_Voltage_OpAmp#9 C?=C?_U_Voltage_OpAmp#12 C?=C?_U_Voltage_OpAmp#10 R?=R?_U_Voltage_OpAmp#14 R?=R?_U_Voltage_OpAmp#13 R?=R?_U_Voltage_OpAmp#15 R?=R?_U_Voltage_OpAmp#16 R?=R?_U_Voltage_OpAmp#23 R?=R?_U_Voltage_OpAmp#21 R?=R?_U_Voltage_OpAmp#19 R?=R?_U_Voltage_OpAmp#17 R?=R?_U_Voltage_OpAmp#22 R?=R?_U_Voltage_OpAmp#24 R?=R?_U_Voltage_OpAmp#20 R?=R?_U_Voltage_OpAmp#18 U?=U?_U_Voltage_OpAmp#2; ports IN1+=NetR?_U_Voltage_OpAmp#15_1 IN1-=NetR?_U_Voltage_OpAmp#14_1 IN2+=NetR?_U_Voltage_OpAmp#19_1 IN2-=NetR?_U_Voltage_OpAmp#21_1 IN3+=NetR?_U_Voltage_OpAmp#20_2 IN3-=NetR?_U_Voltage_OpAmp#22_2 OUT1=Net*_24 OUT2=Net*_25 OUT3=Net*_11

### Notes on the sheet
- Discusses how the caps are ised to measure u off frequency <https://www.ti.com/lit/ug/sbou252/sbou252.pdf?ts=1687733715900&ref_url=https%253A%252F%252Fwww.ti.com%252Fproduct%252FTLV9004-Q1>

### Library data of the parts
C?#1-C?#6 = GCM1555C1H331JA16D: CAP CER 330PF 50V C0G/NP0 0402; manufacturer: Murata Electronics; Temperature Coefficient: C0G, NP0; Tolerance: ±5%; Part Number: GCM1555C1H331JA16D; Value: 330 pF; Applications: Automotive; Capacitance: 330 pF; componentlink1description: Datasheet; componentlink1url: https://www.murata.com/~/media/webrenewal/support/library/catalog/products/capacitor/mlcc/c03e.ashx?la=en-us; componentlink2description: DigiKey Link; componentlink2url: https://www.digikey.com/en/products/detail/murata-electronics/GCM1555C1H331JA16D/1765176; Device Package: 0402 (1005 Metric); lastupdated: 2023-06-25 7:06:19 PM; Lifecycle Status: Active; Minimum Order: 1; Mounting Type: Surface Mount, MLCC; Operating Temperature: -55°C ~ 125°C; Package / Case: 0402 (1005 Metric); packaging: TapeAndReel; partid: 2978; Part Status: Active; price: 0.01; Ratings: AEC-Q200; series: GCM; Size / Dimension: 0.039" L x 0.020" W (1.00mm x 0.50mm); Supplier 1: DigiKey; Supplier Part Number 1: 490-4928-1-ND; Thickness (Max): 0.022" (0.55mm); Voltage - Rated: 50V
R?#1 R?#4-R?#6 R?#11 R?#12 = ERA-2AEB332X: RES SMD 3.3K OHM 0.1% 1/16W 0402; Manufacturer: Panasonic Electronic Components; Power (Watts): 0.063W, 1/16W; Resistance: 3.3 kOhms; Temperature Coefficient: ±25ppm/°C; Part Number: ERA-2AEB332X; Value: 3.3 kR; ComponentLink1Description: Datasheet; ComponentLink1URL: https://industrial.panasonic.com/cdbs/www-data/pdf/RDM0000/AOA0000C307.pdf; ComponentLink2Description: DigiKey Link; ComponentLink2URL: https://www.digikey.com/en/products/detail/panasonic-electronic-components/ERA-2AEB332X/1706017; Composition: Thin Film; Device Package: 0402 (1005 Metric); Features: Automotive AEC-Q200; Height - Seated (Max): 0.016" (0.40mm); LastUpdated: 2023-06-25 7:35:55 PM; Lifecycle Status: Active; Minimum Order: 1; Number of Terminations: 2; Operating Temperature: -55°C ~ 155°C; Package / Case: 0402 (1005 Metric); Packaging: TapeAndReel; PartId: 6110; Part Status: Active; Price: 0.05; Ratings: AEC-Q200; Series: ERA-2A; Size / Dimension: 0.039" L x 0.020" W (1.00mm x 0.50mm); Supplier 1: DigiKey; Supplier Part Number 1: P3.3KDCCT-ND; Supplier Device Package: 0402; Tolerance: ±0.1%
R?#2 R?#3 R?#7-R?#10 = ERA-2AEB4021X: RES SMD 4.02KOHM 0.1% 1/16W 0402; Manufacturer: Panasonic Electronic Components; Power (Watts): 0.063W, 1/16W; Resistance: 4.02 kOhms; Temperature Coefficient: ±25ppm/°C; Part Number: ERA-2AEB4021X; Value: 4.02 kR; ComponentLink1Description: Datasheet; ComponentLink1URL: https://industrial.panasonic.com/cdbs/www-data/pdf/RDM0000/AOA0000C307.pdf; ComponentLink2Description: DigiKey Link; ComponentLink2URL: https://www.digikey.com/en/products/detail/panasonic-electronic-components/ERA-2AEB4021X/2026107; Composition: Thin Film; Device Package: 0402 (1005 Metric); Features: Automotive AEC-Q200; Height - Seated (Max): 0.016" (0.40mm); LastUpdated: 2023-06-25 7:35:55 PM; Lifecycle Status: Active; Minimum Order: 1; Number of Terminations: 2; Operating Temperature: -55°C ~ 155°C; Package / Case: 0402 (1005 Metric); Packaging: TapeAndReel; PartId: 6101; Part Status: Active; Price: 0.05; Ratings: AEC-Q200; Series: ERA-2A; Size / Dimension: 0.039" L x 0.020" W (1.00mm x 0.50mm); Supplier 1: DigiKey; Supplier Part Number 1: P4.02KDCCT-ND; Supplier Device Package: 0402; Tolerance: ±0.1%
U? = TLV9004QDRQ1

## Nets that join several sheets
+3.3: Top_Level (11 pins), U_Half_Bridge_1 (6 pins), MCU (15 pins), U_Half_Bridge_2 (6 pins), U_Half_Bridge_3 (6 pins), CAN (C?#22.2 U?#2.3), bluetooth (11 pins), SD (10 pins), TEMP (21 pins)
+3.3_ISO: Top_Level (GLED?#2.2 Testing_I2C_Bus.3 TP?#8.1), U_Half_Bridge_1 (10 pins), Power (C?#11.2 C?#12.2 D?#3.2), U_Half_Bridge_2 (10 pins), U_Half_Bridge_3 (10 pins), U_Voltage_OpAmp (U?_U_Voltage_OpAmp#1.4), U_Voltage_OpAmp (U?_U_Voltage_OpAmp#2.4)
+12: Top_Level (D?#2.2 Extra_Power.1 Extra_Power.2 TP?#6.1), U_Half_Bridge_1 (5 pins), Power (9 pins), U_Half_Bridge_2 (5 pins), U_Half_Bridge_3 (5 pins)
GND: Top_Level (36 pins), U_Half_Bridge_1 (38 pins), Power (18 pins), MCU (25 pins), U_Half_Bridge_2 (38 pins), U_Half_Bridge_3 (38 pins), CAN (6 pins), bluetooth (27 pins), SD (C?#40.1 J?#17.6 J?#17.S), TEMP (28 pins)
GND_ISO: Top_Level (7 pins), U_Half_Bridge_1 (10 pins), Power (C?#11.1 C?#12.1 T?.2), U_Half_Bridge_2 (10 pins), U_Half_Bridge_3 (10 pins), U_Voltage_OpAmp (7 pins), U_Voltage_OpAmp (7 pins)
Net*_2: MCU (*.2), SD (J?#17.2 R?#26.3)
Net*_8: Top_Level (C?#10.2 HALL.5 R?#6.2), MCU (*.8)
Net*_9: MCU (*.9), SD (J?#17.3 R?#27.8)
Net*_10: MCU (*.10), U_Voltage_OpAmp (C?_U_Voltage_OpAmp#5.1 R?_U_Voltage_OpAmp#11.1 U?_U_Voltage_OpAmp#1.7)
Net*_11: MCU (*.11), U_Voltage_OpAmp (C?_U_Voltage_OpAmp#12.1 R?_U_Voltage_OpAmp#24.1 U?_U_Voltage_OpAmp#2.8)
Net*_14: Top_Level (USART.3), MCU (*.14)
Net*_15: Top_Level (USART.4), MCU (*.15)
Net*_16: Top_Level (USART.2), MCU (*.16)
Net*_17: Top_Level (USART.1), MCU (*.17)
Net*_20: Top_Level (USART.5), MCU (*.20)
Net*_21: U_Half_Bridge_1 (R?_U_Half_Bridge_1#9.1), MCU (*.21)
Net*_22: MCU (*.22), U_Voltage_OpAmp (C?_U_Voltage_OpAmp#6.1 R?_U_Voltage_OpAmp#12.1 U?_U_Voltage_OpAmp#1.8)
Net*_23: MCU (*.23), U_Voltage_OpAmp (C?_U_Voltage_OpAmp#1.2 R?_U_Voltage_OpAmp#1.2 U?_U_Voltage_OpAmp#1.1)
Net*_24: MCU (*.24), U_Voltage_OpAmp (C?_U_Voltage_OpAmp#7.2 R?_U_Voltage_OpAmp#13.2 U?_U_Voltage_OpAmp#2.1)
Net*_25: MCU (*.25), U_Voltage_OpAmp (C?_U_Voltage_OpAmp#11.1 R?_U_Voltage_OpAmp#23.1 U?_U_Voltage_OpAmp#2.7)
Net*_26: MCU (*.26), U_Half_Bridge_2 (R?_U_Half_Bridge_2#9.1)
Net*_27: MCU (*.27), U_Half_Bridge_3 (R?_U_Half_Bridge_3#9.1)
Net*_29: Top_Level (Testing_I2C_Bus.2), MCU (*.29), bluetooth (U?#3.37)
Net*_33: MCU (*.33), CAN (U?#2.1)
Net*_34: MCU (*.34), CAN (U?#2.4)
Net*_36: MCU (*.36), TEMP (9 pins)
Net*_37: U_Half_Bridge_1 (R?_U_Half_Bridge_1#7.1), MCU (*.37)
Net*_38: MCU (*.38), U_Half_Bridge_2 (R?_U_Half_Bridge_2#7.1)
Net*_39: MCU (*.39), U_Half_Bridge_3 (R?_U_Half_Bridge_3#7.1)
Net*_40: MCU (*.40), TEMP (9 pins)
Net*_41: MCU (*.41), TEMP (9 pins)
Net*_42: Top_Level (D?#1.5 R?#1.1 R?#2.1), MCU (*.42)
Net*_43: MCU (*.43), bluetooth (U?#3.27)
Net*_44: Top_Level (J?#8.2), MCU (*.44)
Net*_45: Top_Level (J?#9.2), MCU (*.45)
Net*_46: Top_Level (J?#1.2), MCU (*.46)
Net*_49: Top_Level (J?#1.4), MCU (*.49)
Net*_50: Top_Level (J?#1.8), MCU (*.50)
Net*_51: MCU (*.51), SD (J?#17.5 R?#27.7)
Net*_52: MCU (*.52), SD (J?#17.7 R?#27.6)
Net*_53: Top_Level (Testing_I2C_Bus.1), MCU (*.53), bluetooth (U?#3.29)
Net*_55: Top_Level (J?#1.6), MCU (*.55)
Net*_56: Top_Level (J?#1.10), MCU (*.56)
Net*_58: MCU (*.58), bluetooth (U?#3.28)
Net*_59: Top_Level (C?#9.2 R?#7.2), MCU (*.59)
Net*_61: Top_Level (C?#8.2 R?#8.2), MCU (*.61)
Net*_62: Top_Level (C?#7.2 R?#9.2), MCU (*.62)
NetC?#24_2: Top_Level (CAN.2), CAN (C?#24.2 D?#4.2 L?#1.3 R?#21.2)
NetC?#25_2: Top_Level (CAN.1), CAN (C?#25.2 D?#4.1 L?#1.2 R?#22.2)
NetC?#29_2: Top_Level (NFC.2), bluetooth (C?#29.2 U?#3.11)
NetC?#30_2: Top_Level (NFC.1), bluetooth (C?#30.2 U?#3.12)
NetJ?#11_1: Top_Level (J?#11.1 TP?#3.1), U_Half_Bridge_1 (R?_U_Half_Bridge_1#4.2 R?_U_Half_Bridge_1#8.2 R?_U_Half_Bridge_1#10.2 R?_U_Half_Bridge_1#18.1)
NetJ?#12_1: Top_Level (J?#12.1 TP?#4.1), U_Half_Bridge_2 (R?_U_Half_Bridge_2#4.2 R?_U_Half_Bridge_2#8.2 R?_U_Half_Bridge_2#10.2 R?_U_Half_Bridge_2#18.1)
NetJ?#13_1: Top_Level (J?#13.1 TP?#5.1), U_Half_Bridge_3 (R?_U_Half_Bridge_3#4.2 R?_U_Half_Bridge_3#8.2 R?_U_Half_Bridge_3#10.2 R?_U_Half_Bridge_3#18.1)
NetR?_U_Voltage_OpAmp#2_1: U_Half_Bridge_2 (U?_U_Half_Bridge_2#3.7), U_Voltage_OpAmp (R?_U_Voltage_OpAmp#2.1)
NetR?_U_Voltage_OpAmp#3_1: U_Half_Bridge_2 (U?_U_Half_Bridge_2#3.6), U_Voltage_OpAmp (R?_U_Voltage_OpAmp#3.1)
NetR?_U_Voltage_OpAmp#7_1: U_Half_Bridge_1 (U?_U_Half_Bridge_1#2.7), U_Voltage_OpAmp (R?_U_Voltage_OpAmp#7.1)
NetR?_U_Voltage_OpAmp#8_2: U_Half_Bridge_1 (U?_U_Half_Bridge_1#3.6), U_Voltage_OpAmp (R?_U_Voltage_OpAmp#8.2)
NetR?_U_Voltage_OpAmp#9_1: U_Half_Bridge_1 (U?_U_Half_Bridge_1#2.6), U_Voltage_OpAmp (R?_U_Voltage_OpAmp#9.1)
NetR?_U_Voltage_OpAmp#10_2: U_Half_Bridge_1 (U?_U_Half_Bridge_1#3.7), U_Voltage_OpAmp (R?_U_Voltage_OpAmp#10.2)
NetR?_U_Voltage_OpAmp#14_1: U_Half_Bridge_3 (U?_U_Half_Bridge_3#2.6), U_Voltage_OpAmp (R?_U_Voltage_OpAmp#14.1)
NetR?_U_Voltage_OpAmp#15_1: U_Half_Bridge_3 (U?_U_Half_Bridge_3#2.7), U_Voltage_OpAmp (R?_U_Voltage_OpAmp#15.1)
NetR?_U_Voltage_OpAmp#19_1: U_Half_Bridge_3 (U?_U_Half_Bridge_3#3.6), U_Voltage_OpAmp (R?_U_Voltage_OpAmp#19.1)
NetR?_U_Voltage_OpAmp#20_2: U_Half_Bridge_2 (U?_U_Half_Bridge_2#2.7), U_Voltage_OpAmp (R?_U_Voltage_OpAmp#20.2)
NetR?_U_Voltage_OpAmp#21_1: U_Half_Bridge_3 (U?_U_Half_Bridge_3#3.7), U_Voltage_OpAmp (R?_U_Voltage_OpAmp#21.1)
NetR?_U_Voltage_OpAmp#22_2: U_Half_Bridge_2 (U?_U_Half_Bridge_2#2.6), U_Voltage_OpAmp (R?_U_Voltage_OpAmp#22.2)
VIN: Top_Level (10 pins), U_Half_Bridge_1 (7 pins), Power (Cin.1 U1.2 U1.3), U_Half_Bridge_2 (7 pins), U_Half_Bridge_3 (7 pins)